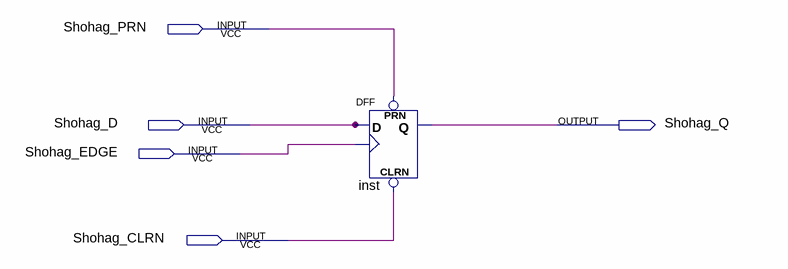
[diagram p0: schematic sheet]
// Quartus schematic Shohag_D_Flip_Flop_block.bdf as structural Verilog: 1 symbols, 5 pins
module Shohag_D_Flip_Flop_block (
  input  Shohag_PRN,
  input  Shohag_D,
  input  Shohag_EDGE,
  input  Shohag_CLRN,
  output Shohag_Q
);

  DFF inst (.CLRN(Shohag_CLRN), .CLK(Shohag_EDGE), .D(Shohag_D), .PRN(Shohag_PRN), .Q(Shohag_Q));
endmodule
